# Altium schematic sheet GPS.SchDoc
size B; SheetNumber: 7; SheetTotal: 8
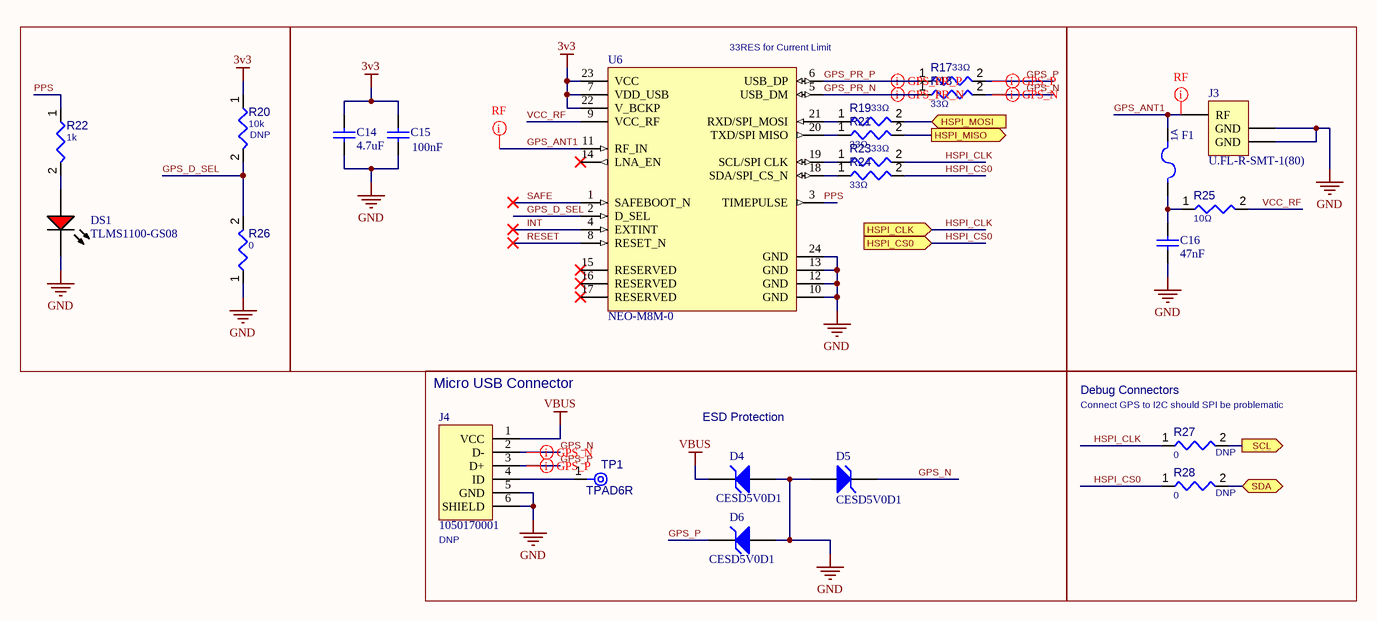
[diagram p0: GPS.SchDoc]

## Parts
C14  Capacitance: 4.7uF  [Capacitor_0402]  (hidden comment: GRM155R60J475ME87D)
C15  Capacitance: 100nF  [Capacitor_0402]  (hidden comment: GRM155R71E104KE14D)
C16  Capacitance: 47nF  [Capacitor_0402]  (hidden comment: GCM155R71H473KE02J)
D4  CESD5V0D1  [JSCJ-SOD-123-2_V]
D5  CESD5V0D1  [JSCJ-SOD-123-2_V]
D6  CESD5V0D1  [JSCJ-SOD-123-2_V]
DS1  TLMS1100-GS08  [VISH-TLMX1100_V]
F1  0466001.NRHF  [FP-0466-MFG]  (value not drawn)
J3  U.FL-R-SMT-1(80)  [FP-U_FL-R-SMT-1_80-MFG]
J4  1050170001  [1050170001-Footprint-1]
R17  value 33Ω  [RESC0402(1005)_L]  (hidden comment: 33R2J)
R18  value 33Ω  [RESC0402(1005)_L]  (hidden comment: 33R2J)
R19  value 33Ω  [RESC0402(1005)_L]  (hidden comment: 33R2J)
R20  value 10k  [RESC0402(1005)_L]  (hidden comment: Resistor 10K  +/-1 % 0402 63 mW)
R21  value 33Ω  [RESC0402(1005)_L]  (hidden comment: 33R2J)
R22  value 1k  [RESC0402(1005)_L]  (hidden comment: Resistor 1K +/-5 % 0402 63 mW)
R23  value 33Ω  [RESC0402(1005)_L]  (hidden comment: 33R2J)
R24  value 33Ω  [RESC0402(1005)_L]  (hidden comment: 33R2J)
R25  value 10Ω  [RESC0402(1005)_L]  (hidden comment: 10R2F)
R26  value 0  [RESC0402(1005)_L]  (hidden comment: Jumper 0402)
R27  value 0  [RESC0402(1005)_L]  (hidden comment: Jumper 0402)
R28  value 0  [RESC0402(1005)_L]  (hidden comment: Jumper 0402)
TP1  TPAD6R  [TP06R]  (no BOM)
U6  NEO-M8M-0  [NEO-M8M-0-Footprint-1]

## Blocks framed on the sheet
33RES for Current Limit: C14 C15 R17-R19 R21 R23 R24 U6
Micro USB Connector: D4-D6 J4 TP1
Debug Connectors: R27 R28

## Ports
HSPI_CLK (in), HSPI_CS0 (in), HSPI_MISO (out), HSPI_MOSI (in), SCL (out), SDA (bidir)

## Nets
3v3: C14.2 C15.2 R20.1 U6.7(VDD_USB) U6.22(V_BCKP) U6.23(VCC)
GND: C14.1 C15.1 C16.1 D4.1(A) D5.1(A) D6.1(A) DS1.2(K) J3.2(GND) J3.3(GND) J4.5(GND) J4.6(SHIELD) R26.1 U6.10(GND) U6.12(GND) U6.13(GND) U6.24(GND)
VBUS: D4.2(K) J4.1(VCC)
GPS_ANT1: F1.2 J3.1(RF) U6.11(RF_IN)
GPS_D_SEL: R20.2 R26.2 U6.2(D_SEL)
GPS_N: D5.2(K) J4.2(D-) R18.2
GPS_P: D6.2(K) J4.3(D+) R17.2
GPS_PR_N: R18.1 U6.5(USB_DM)
GPS_PR_P: R17.1 U6.6(USB_DP)
HSPI_CLK: R23.2 R27.1 ; port HSPI_CLK
HSPI_CS0: R24.2 R28.1 ; port HSPI_CS0
HSPI_MISO: R21.2 ; port HSPI_MISO
HSPI_MOSI: R19.2 ; port HSPI_MOSI
INT: U6.4(EXTINT)
PPS: R22.1 U6.3(TIMEPULSE)
RESET: U6.8(RESET_N)
SAFE: U6.1(SAFEBOOT_N)
SCL: R27.2 ; port SCL
SDA: R28.2 ; port SDA
VCC_RF: R25.2 U6.9(VCC_RF)
NetC16_2: C16.2 F1.1 R25.1
NetDS1_1: DS1.1(A) R22.2
NetJ4_4: J4.4(ID) TP1.1(TP)
NetR19_1: R19.1 U6.21(RXD/SPI_MOSI)
NetR21_1: R21.1 U6.20(TXD/SPI_MISO)
NetR23_1: R23.1 U6.19(SCL/SPI_CLK)
NetR24_1: R24.1 U6.18(SDA/SPI_CS_N)

Not connected (* = marked no-connect by the designer): U6 14(LNA_EN)* 15(RESERVED)* 16(RESERVED)* 17(RESERVED)*

## Layout directives
differential pair; net class USB: GPS_N, GPS_P, GPS_PR_N, GPS_PR_P
net class RF: GPS_ANT1

## Notes on the sheet
- ESD Protection
- (near R27) Connect GPS to I2C should SPI be problematic

## Library data of the parts
C14 = CMP-00000-1: 6.3V 4.7uF X5R ±20% 0402 Multilayer Ceramic Capacitors MLCC - SMD/SMT ROHS; Thickness: 0.022inch; Min Operating Temperature: -55°C; Case Code (Metric): 1005; Depth: 0.5mm; Tolerance: 20%; Width: 0.02inch; Series: GRM; Length: 1mm; Height: 0.5mm; Lead Free: Lead Free; Dielectric: X5R; Construction: Flat; REACH SVHC: No SVHC; Mount: Surface Mount; Radiation Hardening: No; Voltage Rating: 6.3V; RoHS Compliant: Yes; Packaging: Tape and Reel; Voltage Rating (DC): 6.3V; Package Quantity: 1; Max Operating Temperature: 85°C; Case Code (Imperial): 0402
C15 = CMP-001-00084-3: Chip Capacitor 100nF 0402 25V X7R
C16 = CMP-001-00085-1: Cap Ceramic 47nF 50V X7R 10% Pad SMD 0402 125C Automotive T/R; JLCPCB Part #: C697422
D4-D6 = CMP-004-00020-1: Uni-driection ESD Protection Diode, 5 V, 1 uA, 2-Pin SOD-123, RoHS, Tape and Reel; Manufacturer: Jiangsu Changjiang Electronics Technology; Mounting Technology: SM; Case/Package: SOD-123-2; Package Description: 2-Pin Surface Mount Device, Body 2.7 x 1.6 mm; Package Reference: SOD-123-2; RoHS Compliant: Unknown; Package URL: http://www.cj-elec.com/txUpfile/201412112231195145.pdf; Datasheet URL: http://www.cj-elec.com/gallery/txUpfile/f05a5831e2d7f622a930855050fbe076.pdf; Datasheet Version: Rev. B, 04/2014
DS1 = CMP-007-00030-1: Red Led, 20mA, 2.1 V, -40 to 100 degC, 2-Pin SMD (0603), RoHS, Tape and Reel; Manufacturer: Vishay Semiconductor; Forward Voltage: 2.1V; Lens Style: Clear; Luminous Intensity: 63mcd; Power: 90mW; Viewing Angle: 160degrees; Datasheet Version: Rev. 2.7, 03/2016; Package Reference: TLMX1100; Packaging: TapeandReel; Mounting Technology: SM; Illumination Colour: Red; Min Operating Temperature: -40°C; Case/Package: 0603; RoHS Compliant: True; Pins: 2; Max Operating Temperature: 100°C; Datasheet URL: http://www.vishay.com/docs/83173/tlmb1100.pdf; Package Description: 2-Pin Surface Mount Device, Body 1.6 x 0.8 mm; Manufacturer URL: http://www.vishay.com/; Nominal Vf: 2.1V; Colour: Red; Package Quantity: 3000; Forward Current: 20mA; JLCPCB Part #: C2286
F1 = CMP-007-00037-2: Fuse Chip Very Fast Acting 1A 63V SMD Solder Pad 1206 T/R CSA; Value: 1A; JLCPCB Part #: C151135
J3 = CMP-001-0231-3: CONN U.FL RCPT STR 50 OHM SMD; Impedance: 50R; Body Plating: Silver; Number of Ports: 1; Max Frequency: 6GHz; Mating Cycles: 30; Connector Type: Receptacle,Male Pin; Center Contact Plating: Gold; Dielectric Material: Polymer; Body Material: Bronze; Package Quantity: 10000; Max Operating Temperature: 90°C; Case/Package: SMD/SMT; Min Operating Temperature: -40°C; Packaging: Tape and Reel; Fastening Type: SNAP-ON; Series: U.FL; Contact Material: Brass; Mount: Surface Mount; RoHS Compliant: Yes; Termination: Solder; Lead Free: Lead Free; Housing Color: Beige; JLCPCB Part #: C88374
J4 = CMP-002-00075-1: Micro USB Connector; Data Recept.; Micro; B Type; Bottom Mount, SMT, with Solder Tabs, Lead-Free; DNP: DNP; JLCPCB Part #: C136000
R17-R19 R21 R23 R24 = CMP-009-00096-1: 33R 0.063W 5% 0402 (1005 Metric)  SMD; Power: 63mW; Tolerance: 5%; Mounting Technology: SMT; Pins: 2; Case/Package: 0402
R20 = CMP-009-00149-2: Chip Resistor, 10 kOhms, +/-1 %, 63 mW, -55 to 125 degC, 0402; Power: 63mW; Tolerance: 1%; Pins: 2; Max Operating Temperature: 155°C; Min Operating Temperature: -55°C; Case/Package: 0402; DNP: DNP; Parameter 1: *
R22 = CMP-009-00157-2: Chip Resistor, 1 kOhms, +/-5 %, 63 mW, -55 to 155 degC, 0402; Power: 63mW; Tolerance: 5%; Min Operating Temperature: -55°C; Max Operating Temperature: 155°C; Pins: 2; Case/Package: 0402
R25 = CMP-009-00067-1: 10R 0.063W 1% 0402 (1005 Metric)  SMD; Power: 63mW; Mounting Technology: SMT; Pins: 2; Tolerance: 1%; Case/Package: 0402; JLCPCB Part #: C25077
R26-R28 = CMP-009-00148-2: Max Operating Temperature: 155°C; Pins: 2; Case/Package: 0402; Min Operating Temperature: -55°C
  R27 R28: DNP: DNP
TP1 = CMP-00028-00002-1: 0.6mm round; Pins: 1
U6 = CMP-010-00031-1: GPS RF Receiver BeiDou, Galileo, GLONASS, GNSS, GPS 1.575GHz -167dBm